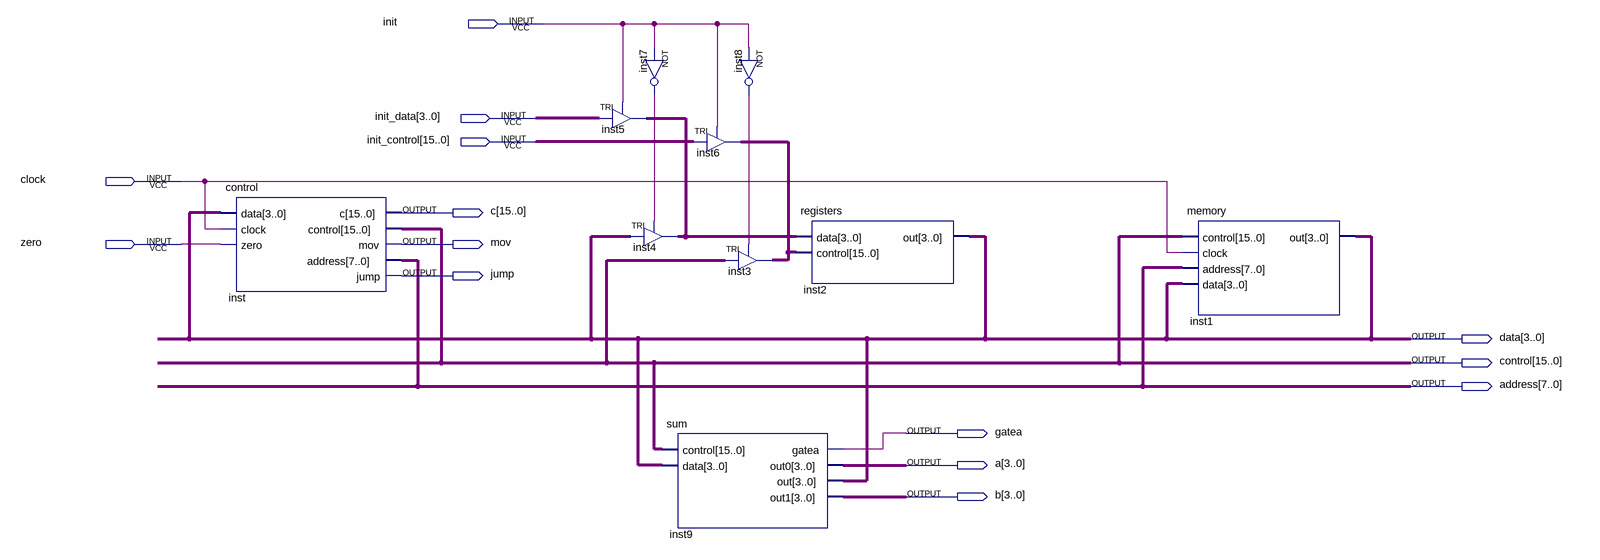
[diagram p0: schematic sheet]
// Quartus schematic sifoLab4.bdf as structural Verilog: 10 symbols, 14 pins
module sifoLab4 (
  input  init,
  input  [3:0] init_data,
  input  [15:0] init_control,
  input  clock,
  input  zero,
  output [15:0] c,
  output mov,
  output jump,
  output [3:0] data,
  output [15:0] control,
  output [7:0] address,
  output gatea,
  output [3:0] a,
  output [3:0] b
);

  wire inst7_out, inst8_out;
  wire [3:0] inst5_out;
  wire [15:0] inst6_out;

  control inst (
    .data(data), .clock(clock), .zero(zero), .c(c), .control(control), .mov(mov), .address(address),
    .jump(jump));
  TRI inst5[3:0] (.IN(init_data), .OE(init), .OUT(inst5_out));
  not inst7 (inst7_out, init);
  TRI inst4[3:0] (.IN(data), .OE(inst7_out), .OUT(inst5_out));
  sum inst9 (.control(control), .data(data), .gatea(gatea), .out0(a), .out(data), .out1(b));
  not inst8 (inst8_out, init);
  TRI inst6[15:0] (.IN(init_control), .OE(init), .OUT(inst6_out));
  TRI inst3[15:0] (.IN(control), .OE(inst8_out), .OUT(inst6_out));
  registers inst2 (.data(inst5_out), .control(inst6_out), .out(data));
  memory inst1 (.control(control), .clock(clock), .address(address), .data(data), .out(data));
endmodule
